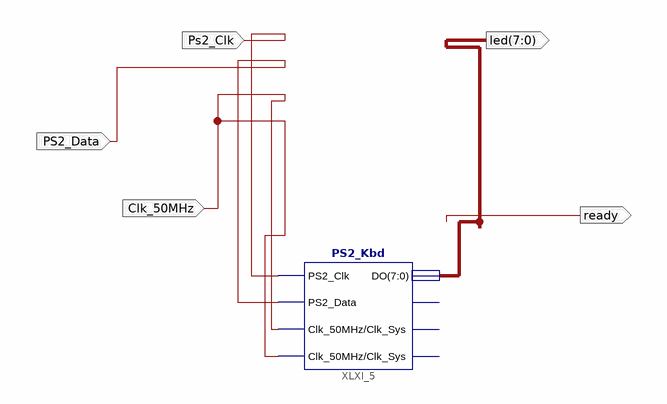
[diagram p0: schematic sheet 1]
// Xilinx ISE schematic keyboard_test1.sch (spartan3e) as structural Verilog: 1 symbols, 5 ports
module keyboard_test1 (
  input  Clk_50MHz,
  input  PS2_Data,
  input  Ps2_Clk,
  output [7:0] led,
  output ready
);

  PS2_Kbd XLXI_5 (
    .PS2_Clk(Ps2_Clk), .PS2_Data(PS2_Data), .Clk_50MHz(Clk_50MHz), .DO(led), .Clk_Sys(Clk_50MHz));  // open: E0, F0, DO_Rdy
endmodule
